# EasyEDA schematic PCB_LCEDA.json
TITLE: 热成像; REV: 1.0; Date: 2024-1; Sheet: 1/1; Drawn By: sheepfidner; Company: 找羊
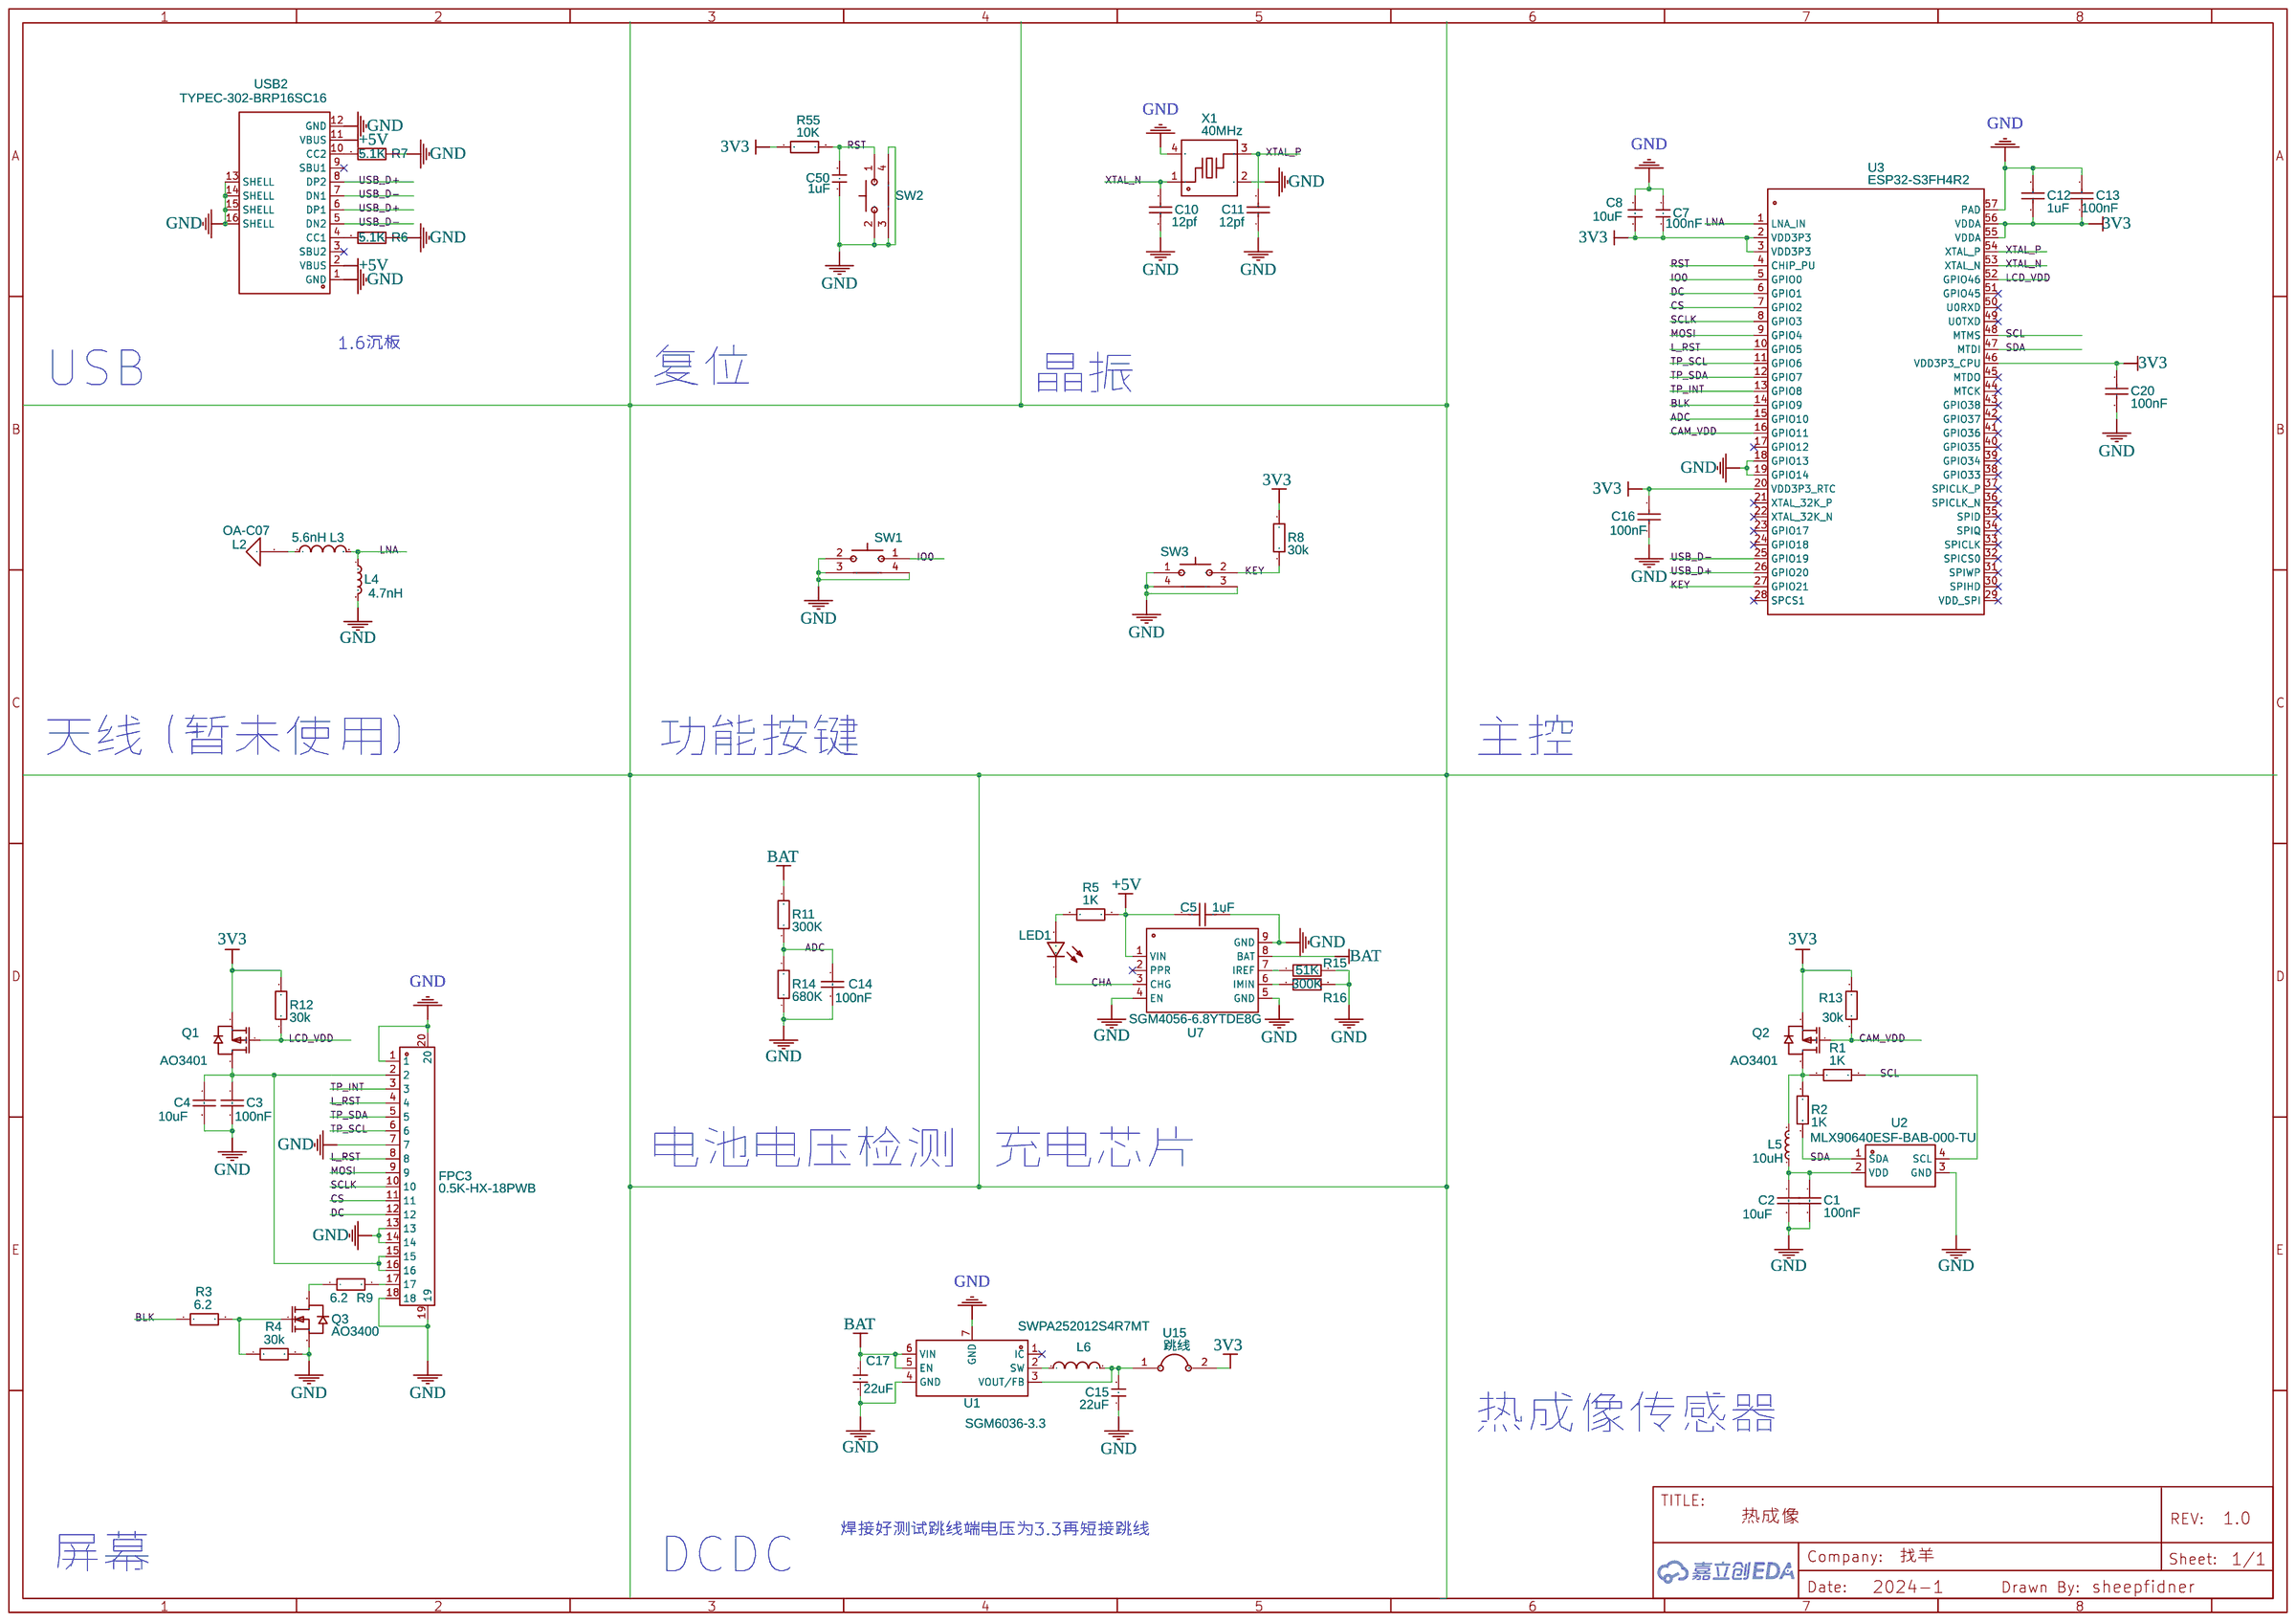
[diagram p0: schematic sheet]

## Parts
C1  100nF  [C0603]
C2  10uF  [C0603]
C3  100nF  [C0603]
C4  10uF  [C0603]
C5  1uF  [C0603]
C7  100nF  [C0603]
C8  10uF  [C0603]
C10  12pf  [C0603]
C11  12pf  [C0603]
C12  1uF  [C0603]
C13  100nF  [C0603]
C14  100nF  [C0603]
C15  22uF  [C0603]
C16  100nF  [C0603]
C17  22uF  [C0603]
C20  100nF  [C0603]
C50  1uF  [C0603]
FPC3  0.5K-HX-18PWB  [FPC-SMD_18P-P0.50_HDGC_0.5K-HX-18PWB]
L2  OA-C07  [OA-C07]
L3  5.6nH  [L0603]
L4  4.7nH  [L0603]
L5  10uH  [0805-L]
L6  SWPA252012S4R7MT  [IND-SMD_L2.5-W2.0_SWPA252012S]
LED1  led-0603  [LED-0603]
Q1  AO3401  [SOT-23-3_L2.9-W1.3-P1.90-LS2.4-BR]
Q2  AO3401  [SOT-23-3_L2.9-W1.3-P1.90-LS2.4-BR]
Q3  AO3400  [SOT-23-3_L2.9-W1.4-P1.91-LS2.6-BR]
R1  1K  [R0603]
R2  1K  [R0603]
R3  6.2  [R0603]
R4  30k  [R0603]
R5  1K  [R0603]
R6  5.1K  [R0603]
R7  5.1K  [R0603]
R8  30k  [R0603]
R9  6.2  [R0603]
R11  300K  [R0603]
R12  30k  [R0603]
R13  30k  [R0603]
R14  680K  [R0603]
R15  51K  [R0603]
R16  300K  [R0603]
R55  10K  [R0603]
SW1  1TS003B  [KEY-SMD_1TS003B]
SW2  1TS003B  [KEY-SMD_1TS003B]
SW3  1TS003B  [KEY-SMD_1TS003B]
U1  SGM6036-3.3  [UTDFN-6_L2.0-W1.5-P0.50-BL-EP]
U2  MLX90640ESF-BAB-000-TU  [TO-39-4_MELEXIS_MLX90640]
U3  ESP32-S3FH4R2  [QFN-56_L7.0-W7.0-P0.40-TL-EP4.6]
U7  SGM4056-6.8YTDE8G  [TDFN-8L_L2.0-W2.0-P0.50-BL-EP]
U15  跳线  [跳线0.5MM]
USB2  TYPEC-302-BRP16SC16  [USB-C-SMD_TYPEC-302-BRP16SC16]
X1  40MHz  [2016_4P]

## Library data of the parts
C1-C5 C7 C8 C14 C15 C17 C50 = cap 0603: Contributor: dhx233
C10-C13 C16 C20 = cap 0402: Contributor: dhx233
FPC3 = 0.5K-HX-18PWB: Contributor: LCSC
L2 = OA-C07: Contributor: dhx233
L3 = L-0402: Contributor: 启凡科创
L4 = L 0603: Contributor: 启凡科创官方
L5 = 0805-L: Contributor: 启凡科创
L6 = SWPA252012S2R2N
LED1 = led-0603: Contributor: 启凡科创官方
Q1 Q2 = AO3401_C2848197: Contributor: LCSC; Supplier: LCSC; Supplier Part: C2848197; Manufacturer: IDCHIP(英锐芯); JLCPCB Part Class: Extended Part
Q3 = AO3400_C2848198: Contributor: LCSC; Supplier: LCSC; Supplier Part: C2848198; Manufacturer: IDCHIP(英锐芯); JLCPCB Part Class: Extended Part
R1-R9 R11-R16 R55 = res-0603: Contributor: dhx233
SW1-SW3 = 1TS003B-1900-3500A: Contributor: LCSC
U1 = SGM6036-ADJYUDT6G/TR: Contributor: lcsc
U2 = MLX90640ESF-BAB-000-TU: Contributor: lcsc
U3 = ESP32-S3R2: Contributor: LCSC
U7 = SGM4056-6.8YTDE8G: Contributor: LCSC
U15 = 跳线: Contributor: xyzDIY
USB2 = TYPEC-302-BRP16SC16: Supplier: LCSC; Supplier Part: C2835313; Manufacturer: XUNPU(讯普); Contributor: LCSC
X1 = 2016_4P: Contributor: 启凡科创

## Nets
3V3: C7.1 C8.1 C12.2 C13.2 C16.1 C20.1 Q1.2(S) Q2.2(S) R8.2 R12.2 R13.2 R55.1 U3.2(VDD3P3) U3.3(VDD3P3) U3.20(VDD3P3_RTC) U3.46(VDD3P3_CPU) U3.55(VDDA) U3.56(VDDA) U15.2
+5V: C5.1 R5.1 U7.1(VIN) USB2.2(VBUS) USB2.11(VBUS)
GND: C1.2 C2.2 C3.2 C4.2 C5.2 C7.2 C8.2 C10.2 C11.1 C12.1 C13.1 C14.2 C15.1 C16.2 C17.1 C20.2 C50.1 FPC3.1 FPC3.7 FPC3.13 FPC3.14 FPC3.18 FPC3.19 FPC3.20 L4.2 Q3.2(S) R4.2 R6.2 R7.1 R14.1 R15.1 R16.1 SW1.2 SW1.3 SW1.4 SW2.2 SW2.3 SW2.4 SW3.1 SW3.3 SW3.4 U1.4(GND) U1.7(GND) U2.3(GND) U3.18(GPIO13) U3.19(GPIO14) U3.57(PAD) U7.4(EN) U7.5(GND) U7.9(GND) USB2.1(GND) USB2.12(GND) USB2.13(SHELL) USB2.14(SHELL) USB2.15(SHELL) USB2.16(SHELL) X1.2(GND) X1.4(GND)
ADC: C14.1 R11.1 R14.2 U3.15(GPIO10)
BAT: C17.2 R11.2 U1.5(EN) U1.6(VIN) U7.8(BAT)
BLK: R3.1 U3.14(GPIO9)
CAM_VDD: Q2.1(G) R13.1 U3.16(GPIO11)
CHA: LED1.1(C) U7.3(CHG)
CS: FPC3.11 U3.7(GPIO2)
DC: FPC3.12 U3.6(GPIO1)
IO0: SW1.1 U3.5(GPIO0)
KEY: R8.1 SW3.2 U3.27(GPIO21)
L_RST: FPC3.4 FPC3.8 U3.10(GPIO5)
LCD_VDD: Q1.1(G) R12.1 U3.52(GPIO46)
LNA: L3.2 L4.1 U3.1(LNA_IN)
MOSI: FPC3.9 U3.9(GPIO4)
RST: C50.2 R55.2 SW2.1 U3.4(CHIP_PU)
SCL: R1.1 U2.4(SCL) U3.48(MTMS)
SCLK: FPC3.10 U3.8(GPIO3)
SDA: R2.1 U2.1(SDA) U3.47(MTDI)
TP_INT: FPC3.3 U3.13(GPIO8)
TP_SCL: FPC3.6 U3.11(GPIO6)
TP_SDA: FPC3.5 U3.12(GPIO7)
USB_D+: U3.26(GPIO20) USB2.6(DP1) USB2.8(DP2)
USB_D-: U3.25(GPIO19) USB2.5(DN2) USB2.7(DN1)
XTAL_N: C10.1 U3.53(XTAL_N) X1.1
XTAL_P: C11.2 U3.54(XTAL_P) X1.3
Net-(C1-1): C1.1 C2.1 L5.1 U2.2(VDD)
Net-(C3-1): C3.1 C4.1 FPC3.2 FPC3.15 FPC3.16 Q1.3(D)
Net-(C15-2): C15.2 L6.2 U1.3(VOUT/FB) U15.1
Net-(FPC3-17): FPC3.17 R9.2
Net-(L2-1): L2.1 L3.1
Net-(L5-2): L5.2 Q2.3(D) R1.2 R2.2
Net-(L6-1): L6.1 U1.2(SW)
Net-(LED1-2): LED1.2(A) R5.2
Net-(Q3-1): Q3.1(G) R3.2 R4.1
Net-(Q3-3): Q3.3(D) R9.1
Net-(R6-1): R6.1 USB2.4(CC1)
Net-(R7-2): R7.2 USB2.10(CC2)
Net-(R15-2): R15.2 U7.7(IREF)
Net-(R16-2): R16.2 U7.6(IMIN)

Not connected (* = marked no-connect by the designer): U1 1(IC)*; U3 17(GPIO12)* 21(XTAL_32K_P)* 22(XTAL_32K_N)* 23(GPIO17)* 24(GPIO18)* 28(SPCS1)* 29(VDD_SPI)* 30(SPIHD)* 31(SPIWP)* 32(SPICS0)* 33(SPICLK)* 34(SPIQ)* 35(SPID)* 36(SPICLK_N)* 37(SPICLK_P)* 38(GPIO33)* 39(GPIO34)* 40(GPIO35)* 41(GPIO36)* 42(GPIO37)* 43(GPIO38)* 44(MTCK)* 45(MTDO)* 49(U0TXD)* 50(U0RXD)* 51(GPIO45)*; U7 2(PPR)*; USB2 3(SBU2)* 9(SBU1)*

## Notes on the sheet
- 1.6沉板
- USB
- 复位
- 晶振
- 天线（暂未使用）
- 功能按键
- 主控
- 电池电压检测
- 充电芯片
- 热成像传感器
- 焊接好测试跳线端电压为3.3再短接跳线
- 屏幕
- DCDC
